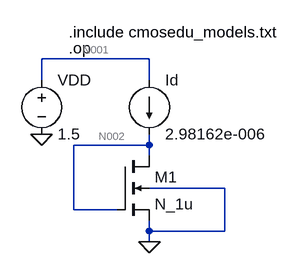
[diagram p0: schematic Parte 2.asc]
Parte 2.asc, the LTspice schematic file:
Version 4
SHEET 1 880 680
WIRE 192 32 32 32
WIRE 32 64 32 32
WIRE 192 64 192 32
WIRE 192 160 192 144
WIRE 192 160 80 160
WIRE 192 176 192 160
WIRE 304 224 192 224
WIRE 80 256 80 160
WIRE 144 256 80 256
WIRE 192 288 192 272
WIRE 304 288 304 224
WIRE 304 288 192 288
WIRE 192 304 192 288
FLAG 192 304 0
FLAG 32 144 0
SYMBOL nmos4 144 176 R0
SYMATTR InstName M1
SYMATTR Value N_1u
SYMATTR Value2 l=1.5u w=3u
SYMBOL current 192 64 R0
WINDOW 123 0 0 Left 2
WINDOW 39 0 0 Left 2
SYMATTR InstName Id
SYMATTR Value 2.98162e-006
SYMBOL voltage 32 48 R0
WINDOW 123 0 0 Left 2
WINDOW 39 0 0 Left 2
SYMATTR InstName VDD
SYMATTR Value 1.5
TEXT 72 -8 Left 2 !.include cmosedu_models.txt
TEXT 72 16 Left 2 !.op

The netlist it stands for:
* Parte 2.asc
M1 N002 N002 0 0 N_1u l=1.5u w=3u
Id N001 N002 2.98162e-006
VDD N001 0 1.5
.model NMOS NMOS
.model PMOS PMOS
.lib standard.mos
.include cmosedu_models.txt
.op
.backanno
.end

* Results of the author's LTspice run, read from the files saved beside the schematic
* Operating Point:
*   V(n002) = 1 V
*   V(n001) = 1.5 V
*   Id(M1) = 2.982 µA
*   Ig(M1) = 0 A
*   Ib(M1) = -1.01 pA
*   Is(M1) = -2.982 µA
*   I(Id) = 2.982 µA
*   I(Vdd) = -2.982 µA
* From the log:
*   Semiconductor Device Operating Points:
*                           --- MOSFET Transistors ---
*   Name:          m1
*   Model:        n_1u
*   Id:          2.98e-06
*   Vgs:         1.00e+00
*   Vds:         1.00e+00
*   Vbs:         0.00e+00
*   Vth:         8.90e-01
*   Vdsat:       1.32e-01
*   Gm:          3.43e-05
*   Gds:         1.49e-07
*   Gmb:         1.20e-05
*   Cbd:         0.00e+00
*   Cbs:         0.00e+00
*   Cgsov:       6.00e-16
*   Cgdov:       6.00e-16
*   Cgbov:       1.30e-16
*   Cgs:         4.49e-15
*   Cgd:         0.00e+00
*   Cgb:         0.00e+00